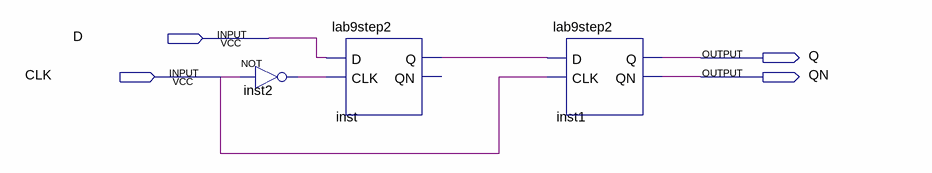
[diagram p0: schematic sheet]
// Quartus schematic lab9step3b.bdf as structural Verilog: 3 symbols, 4 pins
module lab9step3b (
  input  D,
  input  CLK,
  output Q,
  output QN
);

  wire inst2_out, inst_q;

  not inst2 (inst2_out, CLK);
  lab9step2 inst (.D(D), .CLK(inst2_out), .Q(inst_q));  // open: QN
  lab9step2 inst1 (.D(inst_q), .CLK(CLK), .Q(Q), .QN(QN));
endmodule
